# Altium schematic sheet USB.SchDoc
size A4; DocumentNumber: 2; SheetNumber: 4; SheetTotal: 8
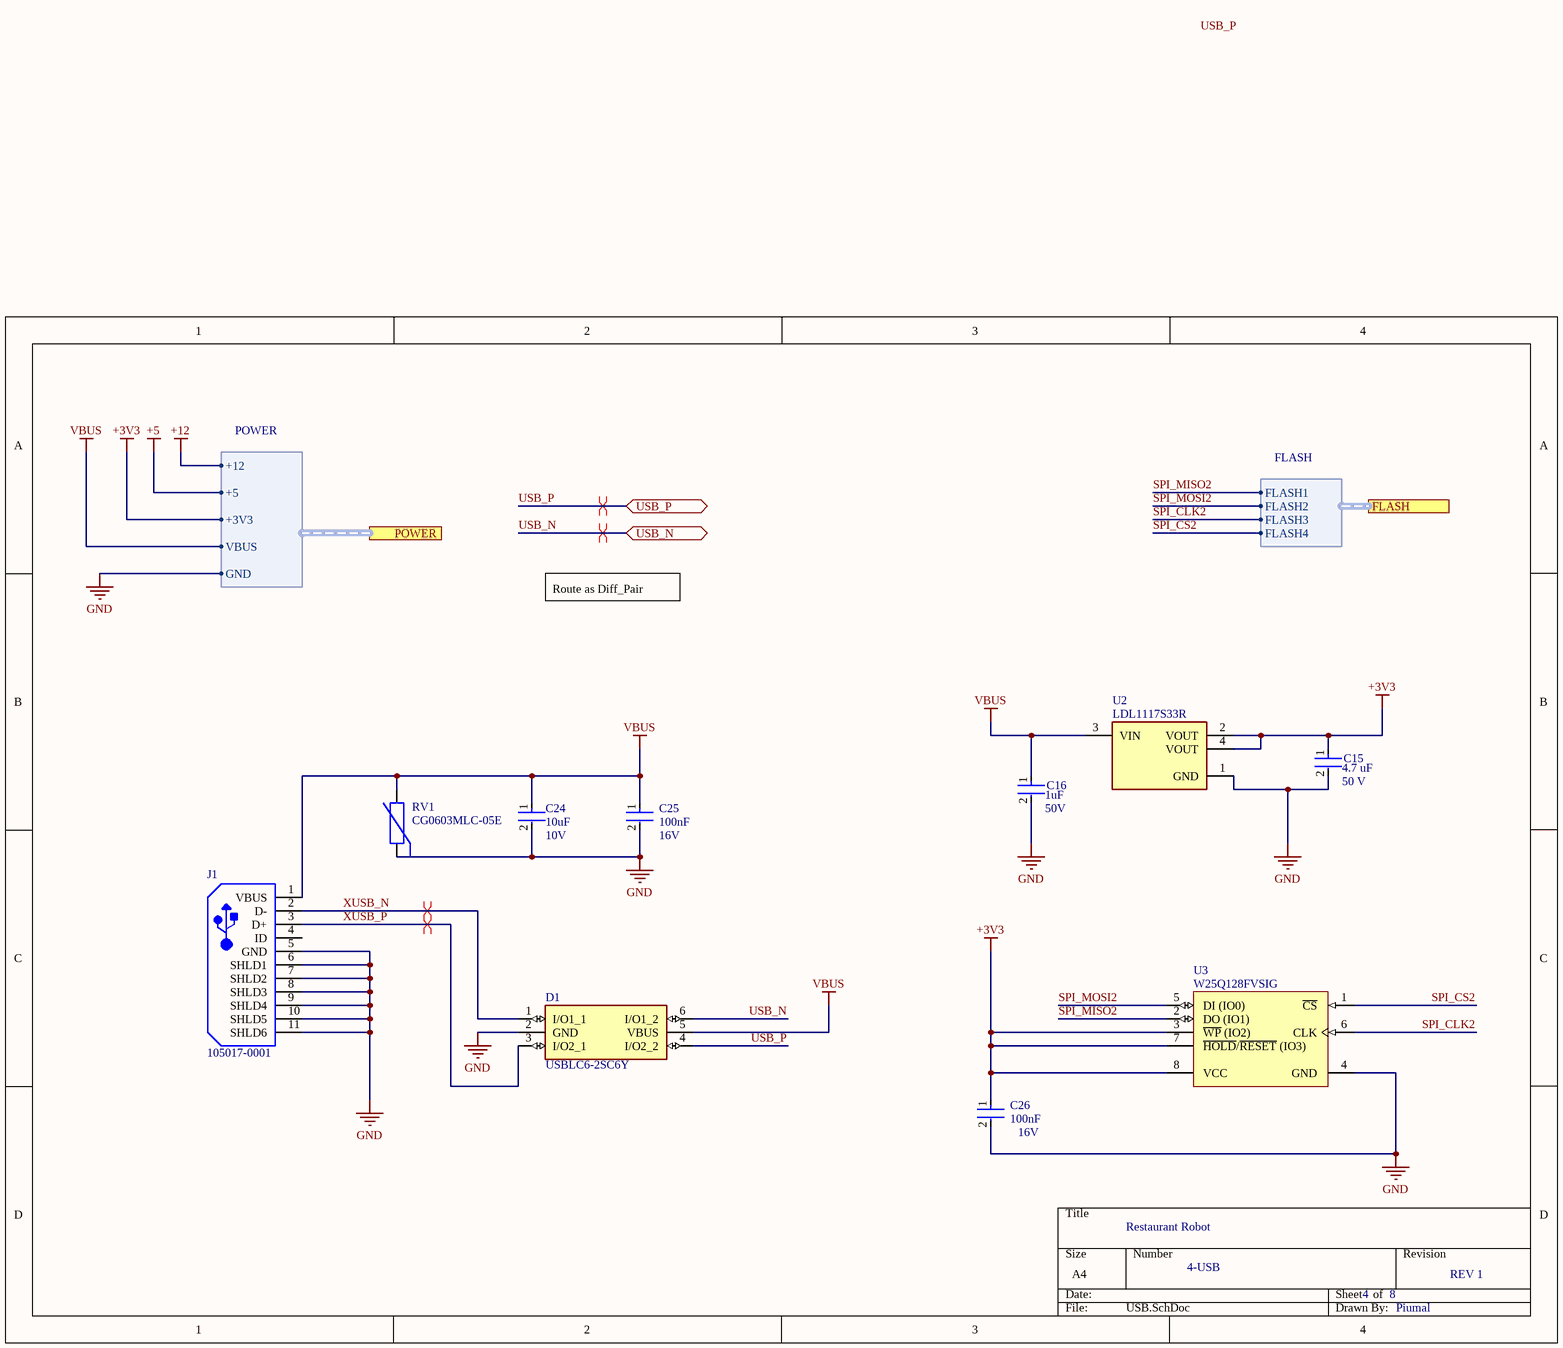
[diagram p0: USB.SchDoc]

## Parts
C15  Voltage Rating: 50 V  Capacitance: 4.7 uF  [FP-CC1206-1_25-MFG]  (hidden comment: CC1206KKX7R9BB475)
C16  Voltage Rating: 50V  Capacitance: 1uF  [FP-1206-L_3_2_0_2-W_1_6_0-IPC_A]  (hidden comment: 12065C105KAT2A)
C24  Voltage: 10V  Capacitance: 10uF  [FP-1206-L_3_2_0_2-W_1_6_0-IPC_A]  (hidden comment: 1206ZD106KAT2A)
C25  Voltage Rating (DC): 16V  Capacitance: 100nF  [FP-CL21-IPC_A]  (hidden comment: CL21B104KOANNNC)
C26  Voltage Rating (DC): 16V  Capacitance: 100nF  [FP-CL21-IPC_A]  (hidden comment: CL21B104KOANNNC)
D1  USBLC6-2SC6Y  [SOT95P280X145-6N]
J1  105017-0001  [USB-MICRO-B_V]
RV1  CG0603MLC-05E  [BOUR-CG0603-2_V]
U2  LDL1117S33R  [FP-SOT223-0046067-IPC_C]
U3  W25Q128FVSIG  [WINB-SOIC-8_M]

## Ports
FLASH (harness FLASH), POWER (harness POWER), USB_N (bidir), USB_P (bidir)

## Harnesses
FLASH: FLASH1, FLASH2, FLASH3, FLASH4
POWER: +3V3, GND, +5, VBUS, +12

## Nets
+3V3: C15.1 C26.1 U2.2(VOUT) U2.4(VOUT) U3.3(~{WP}_(IO2)) U3.7(~{HOLD}/~{RESET}_(IO3)) U3.8(VCC) ; port POWER.+3V3
+5: port POWER.+5
+12: port POWER.+12
GND: C15.2 C16.2 C24.2 C25.2 C26.2 D1.2(GND) J1.5(GND) J1.6(SHLD1) J1.7(SHLD2) J1.8(SHLD3) J1.9(SHLD4) J1.10(SHLD5) J1.11(SHLD6) RV1.1 U2.1(GND) U3.4(GND) ; port POWER.GND
VBUS: C16.1 C24.1 C25.1 D1.5(VBUS) J1.1(VBUS) RV1.2 U2.3(VIN) ; port POWER.VBUS
SPI_CLK2: U3.6(CLK) ; port FLASH.FLASH3
SPI_CS2: U3.1(~{CS}) ; port FLASH.FLASH4
SPI_MISO2: U3.2(DO_(IO1)) ; port FLASH.FLASH1
SPI_MOSI2: U3.5(DI_(IO0)) ; port FLASH.FLASH2
USB_N: D1.6(I/O1_2) ; port USB_N
USB_P: D1.4(I/O2_2) ; port USB_P
XUSB_N: D1.1(I/O1_1) J1.2(D-)
XUSB_P: D1.3(I/O2_1) J1.3(D+)

Not connected (* = marked no-connect by the designer): J1 4(ID)

## Layout directives
differential pair: USB_N, USB_P, XUSB_N, XUSB_P

## Notes on the sheet
- Route as Diff_Pair
- Restaurant Robot
- 4-USB
- 4
- 8
- REV 1
- Piumal
- Labels drawn without touching a wire or pin: USB_P

## Library data of the parts
C15 = CMP-03422-000173-1: CAP CER 4.7UF 50V X7R 1206; Manufacturer: Yageo; Automotive Grade: NA; Tolerance: 0.1; Temperature Coefficient: 15%; Material: Ceramic; Device Class L1: Passive Components; Category: Cap; Height: 1.45mm; Temperature Range Low: -55°C; Temperature Range High: +125°C; Manufacturer Part Number: CC1206KKX7R9BB475; Package: CC1206-1.25; Lead Free: Yes; Temperature: -55°C to +125°C; RoHS: TRUE; Digikey Description: CAP CER 4.7UF 50V X7R 1206; Device Class L2: Capacitors; Footprint Url: http://www.yageo.com/exep/pages/download/literatures/UPY-C_GEN_24.pdf; ComponentLink2URL: http://www.yageo.com/documents/recent/UPY-NP0X7R_HV_1KV-to-3KV_11.pdf; Temperature Characteristic: X7R; Mouser Description: CC Series 1206 4.7 uF 50 V ±10% Tolerance X7R Multilayer Ceramic Capacitor; ComponentLink2Description: Datasheet; Device Class L3: Ceramic Capacitors; Octopart: https://octopart.com/cc1206kkx7r9bb475-yageo-50417574; Value: 4.7 uF; Automotive: No
C16 = CMP-2000-05866-2: General Purpose Ceramic Capacitor, 1206, 1uF, 10%, X7R, 15%, 50V; Dissipation Factor: 2.5%; Voltage: 25V; Dielectric: X7R; Radiation Hardening: No; Number of Pins: 2; Package Quantity: 1; Case Code (Metric): 3216; Thickness: 0.07inch; Voltage Rating (DC): 50V; Width: 0.063inch; Construction: Flat; Min Operating Temperature: -55°C; Length: 3.2mm; Case Code (Imperial): 1206; Height: 1.78mm; REACH SVHC: No SVHC; Mount: Surface Mount; Max Operating Temperature: 125°C; Depth: 1.6mm; Packaging: Tape and Reel; Tolerance: 10%; Lead Free: Lead Free; Termination: SMD/SMT; RoHS Compliant: Yes; Case/Package: 1206; Contact Plating: Tin; Series: -
C24 = CMP-04427-021870-1: General Purpose Ceramic Capacitor, 1206, 10uF, 10%, X5R, 15%, 10V; Tolerance: 10%; Thickness: 0.07inch; Termination: SMD/SMT; REACH SVHC: No SVHC; Radiation Hardening: No; Lead Free: Lead Free; Min Operating Temperature: -55°C; Contact Plating: Tin; Length: 3.2mm; Dielectric: X5R; Packaging: Tape and Reel; Construction: Flat; RoHS Compliant: Yes; Series: -; Voltage Rating: 10V; Height: 0.07mm; Width: 0.063inch; Voltage Rating (DC): 10V; Mount: Surface Mount; Depth: 1.6mm; Number of Pins: 2; Case Code (Imperial): 1206; Size: 1.78mm; Case/Package: 1206; Max Operating Temperature: 85°C; Package Quantity: 1; Case Code (Metric): 3216
C25 C26 = CMP-13271-003679-1: CL21 Series 0805 100nF 16V ±10% Tolerance X7R Multilayer Ceramic Chip Capacitor; Lead Free: Lead Free; Width: 0.049inch; Tolerance: 10%; Min Operating Temperature: -55°C; Dielectric: X7R; Case Code (Metric): 2012; Packaging: Tape and Reel; Radiation Hardening: No; Length: 2mm; Height: 0.65mm; Voltage Rating: 16V; Mount: Surface Mount; Max Operating Temperature: 125°C; Depth: 1.25mm; Thickness: 0.03inch; Case Code (Imperial): 0805; Case/Package: 0805; Package Quantity: 1
D1 = USBLC6-2SC6Y: 17V Clamp 5A (8/20µs) Ipp Tvs Diode Surface Mount SOT-23-6; MF: STMicroelectronics; SnapEDA_Link: https://www.snapeda.com/parts/USBLC6-2SC6Y/STMicroelectronics/view-part/?ref=snap; Package: SOT-23-6 STMicroelectronics; Value: *; MP: USBLC6-2SC6Y; Check_prices: https://www.snapeda.com/parts/USBLC6-2SC6Y/STMicroelectronics/view-part/?ref=eda
J1 = CMP-2000-05827-1: Micro-USB B Receptacle, Right Angle, Bottom Mount, Surface Mount, with Solder Tabs, -30 to 85 degC, 5-Pin USB, RoHS, Tape and Reel; Manufacturer: Molex; Featured Product: Micro-USBConnectorsUSBConnectors; Other Names: WM1399DKR; Package Version: Rev. F, 12/2012; Number of Contacts: 5; Connector Type: USB-microB; Catalog Drawings: 1050170001; 3D Model: 105017-0001.stp; Mating Products: WM17145-ND-CABLEMICROUSBBTOSTDA1.0MWM17147-ND-CABLEMICROUSBBTOSTDA2.0MWM17146-ND-CABLEMICROUSBBTOSTDA1.5M; PCN Assembly/Origin: ResinSupplier21/Oct/2015; Voltage - Max: 30V; Online Catalog: Molex-MicroUSB; Manufacturer URL: http://www.molex.com/; Package Description: 5-Leads USB, Micro B, Body 7.5 x 5 mm, Pitch 0.65 mm; Datasheet URL: http://www.molex.com/elqNow/elqRedir.htm?ref=http://www.molex.com/webdocs/datasheets/pdf/en-us/1050170001_IO_CONNECTORS.pdf; Ingress Protection: -; Datasheet Version: 03/2016; Mounting Type: BoardCutout,SurfaceMount,RightAngle; Circuits: 5; Standard Package: 1; Package Reference: MICRO-B; Package URL: http://www.molex.com/pdm_docs/sd/1050170001_sd.pdf; Category: Connectors,Interconnects; Series: -; RoHS Information: 1050170001CertofCompliance; Features: Shielded,SolderRetention; Family: USB,DVI,HDMIConnectors; Specifications: -; Gender: Receptacle; Packaging: Digi-Reel®; Mounting Technology: SurfaceMount
RV1 = CMP-0584-00001-2: ESD Protector, 5 V Supply, -40 to 85 degC, 1.6 x 0.8 x 0.55 mm SMD, RoHS, Tape and Reel; Manufacturer: Bourns; VC: 20 V; VT: 150 V; RT: 1 ns; VDC: 5 V; CO: 0.5 pF; PartNumber: CG0603MLC-05E; ComponentLink1Description: Manufacturer URL; ComponentLink1URL: http://www.bourns.com/; Packing: Tape and Reel; Mounting Technology: Surface Mount; ComponentLink2Description: Datasheet; RoHS: TRUE; Operating Temperature: -40 to 85 degC; DatasheetVersion: Rev. S; PackageDescription: 2-Pin SMD, Body 1.6 x 0.8 mm, Pitch 1.52 mm; PackageReference: CG0603-2; ComponentLink2URL: http://www.bourns.com/data/global/pdfs/MLC.pdf
U2 = CMP-12153-000006-1: IC REG LINEAR 3.3V 1.2A SOT223; Manufacturer: STMicroelectronics; Output Type: Fixed; Min Supply Voltage: 2.6V; Number Of Outputs: 1; Dropout Voltage: 350mV; Output Current: 2A; Nominal Supply Current: 250uA; Standoff Height: 0.02mm; Max Supply Voltage: 18V; Max Junction Temp: +125°C; Accuracy Percentage: 2%; Automotive: No; Device Class L2: Power Management ICs; Height: 1.9mm; Octopart: https://octopart.com/ldl1117s33r-stmicroelectronics-81876163; Output Voltage: 3.3V; Package: SOT223-0046067; Lead Free: Yes; Temperature Range Low: -40°C; Category: IC; Device Class L1: Integrated Circuits (ICs); Ipc Land Pattern Name: SOT230P700X190-4; Mouser Description: LDL1117 Series 1.2 A 3.3 V High PSRR LDO Linear Voltage Regulator-SOT-223; ComponentLink2Description: Datasheet; ComponentLink2URL: https://www.st.com/resource/en/datasheet/ldl1117.pdf; Device Class L3: Voltage Regulators - Linear; Manufacturer Part Number: LDL1117S33R; Temperature Range High: +125°C; Digikey Description: IC REG LINEAR 3.3V 1.2A SOT223; Temperature: -40°C to +125°C; RoHS: TRUE
U3 = CMP-2000-05005-1: 3V 128M-Bit Serial Flash Memory with Dual/Quad SPI & QPI, 2.7 to 3.6 V, -40 to 85 degC, 8-Pin SOIC, RoHS, Tape and Reel; Manufacturer: Winbond; Number of Words: 16777216; Address Bus: 24b; Word Size: 8b; Boot Type: NotRequired; Supply Current: 20mA; Operating Supply Voltage (Max): 3.6V; Sync/Async: Synchronous; Rad Hardened: No; Interface Type: Serial(SPI); Access Time (Max): 7ns; Operating Supply Voltage (Min): 2.7V; Operating Supply Voltage (Typ): 3/3.3V; Programmable: Yes; Density: 134217728Bit; Cell Type: NOR; Package Description: 8-Pin Small Outline Integrated Circuit, Body 5.28 x 5.28 mm, Pitch 1.27 mm; Datasheet URL: http://download.siliconexpert.com/pdfs/2015/11/30/6/42/17/890/win_/manual/3w25q128fv20rev.l2008242015.pdf; Package Reference: SS-8; Package Type: SOICW; Datasheet Version: Rev. L, 08/2015; Manufacturer URL: http://www.winbond.com/hq/index.html?__locale=en; Pin Count: 8; Operating Temperature Classification: Industrial; Operating Temperature (Min): -40C; Program/Erase Volt (Typ): 2.7to3.6V; Operating Temperature (Max): 85C; Mounting: SurfaceMount; Operating Temp Range: -40Cto85C